# EAGLE design v110 (EAGLE 7.5.0)
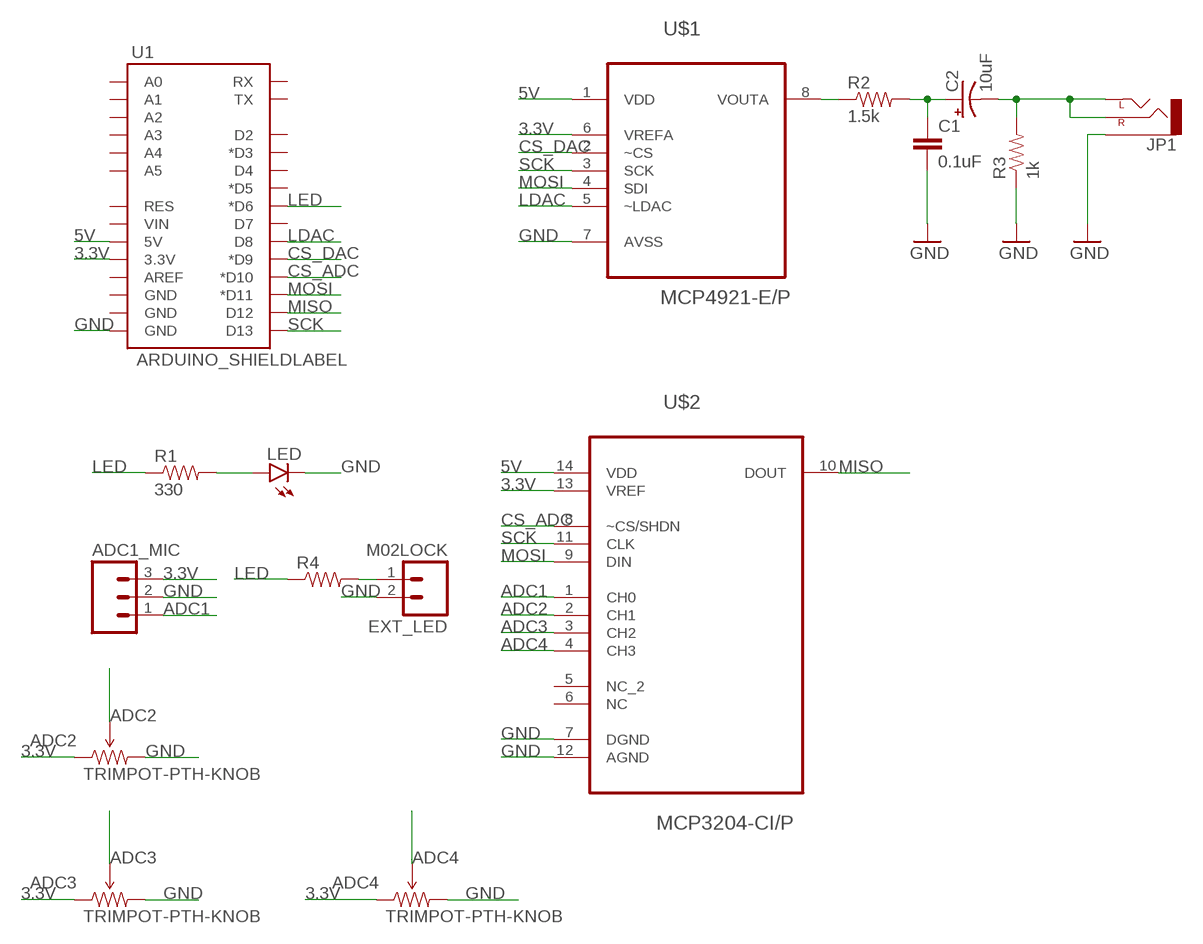
[diagram p0: schematic, sheet 1]

## Parts
ADC1_MIC  M03LOCK  [1X03_LOCK]
ADC2  TRIMPOT-PTH-KNOB  [3386U]
ADC3  TRIMPOT-PTH-KNOB  [3386U]
ADC4  TRIMPOT-PTH-KNOB  [3386U]
C1  0.1uF  CAPPTH1  [CAP-PTH-5MM]
C2  10uF  CAP_POLPTH2  [CPOL-RADIAL-10UF-25V]
EXT_LED  M02LOCK  [1X02_LOCK]
JP1  AUDIO-JACKPTH  [AUDIO-JACK]
LED  LED5MM  [LED5MM]
R1  330  1KOHM-1/4W-5%(PTH)  [AXIAL-0.3]
R2  1.5k  1KOHM-1/4W-5%(PTH)  [AXIAL-0.3]
R3  1k  1KOHM-1/4W-5%(PTH)  [AXIAL-0.3]
R4  1KOHM-1/4W-5%(PTH)  [AXIAL-0.3]
U1  ARDUINO_SHIELDLABEL  [DUEMILANOVE_SHIELD]
U$1  MCP4921-E/P  [DIP254P762X432-8]
U$2  MCP3204-CI/P  [DIP254P762X432-14]

## Nets
3.3V: ADC1_MIC.3 ADC2.1(CCW) ADC3.1(CCW) ADC4.1(CCW) U1.3.3V U$1.6(VREFA) U$2.13(VREF)
5V: U1.5V U$1.1(VDD) U$2.14(VDD)
ADC1: ADC1_MIC.1 U$2.1(CH0)
ADC2: ADC2.2(WIPER) U$2.2(CH1)
ADC3: ADC3.2(WIPER) U$2.3(CH2)
ADC4: ADC4.2(WIPER) U$2.4(CH3)
CS_ADC: U1.D10(*D10) U$2.8(~CS/SHDN)
CS_DAC: U1.D9(*D9) U$1.2(~CS)
GND: ADC1_MIC.2 ADC2.3(CW) ADC3.3(CW) ADC4.3(CW) C1.2 EXT_LED.2 JP1.SLEEVE LED.K(C) R3.P$1 U1.GND@0(GND) U$1.7(AVSS) U$2.7(DGND) U$2.12(AGND)
LDAC: U1.D8 U$1.5(~LDAC)
LED: R1.P$1 R4.P$1 U1.D6(*D6)
MISO: U1.D12 U$2.10(DOUT)
MOSI: U1.D11(*D11) U$1.4(SDI) U$2.9(DIN)
N$1: LED.A R1.P$2
N$2: R2.P$1 U$1.8(VOUTA)
N$3: C1.1 C2.1(+) R2.P$2
N$4: C2.2(-) JP1.RING(RIGHT) JP1.TIP(LEFT) R3.P$2
N$5: EXT_LED.1 R4.P$2
SCK: U1.D13 U$1.3(SCK) U$2.11(CLK)
Unconnected: U1.A0 U1.A1 U1.A2 U1.A3 U1.A4 U1.A5 U1.AREF U1.D2 U1.D3(*D3) U1.D4 U1.D5(*D5) U1.D7 U1.GND@1(GND) U1.GND@2(GND) U1.RES U1.RX U1.TX U1.VIN U$2.5(NC_2) U$2.6(NC)

## Library data of the parts
ADC1_MIC = SparkFun-Connectors:M03: Header 3 Standard 3-pin 0.1" header. Use with straight break away headers (SKU : PRT-00116), right angle break away headers (PRT-00553), swiss pins (PRT-00743), machine pins (PRT-00117), and female headers (PRT-00115). Molex polarized connector foot print use with SKU : PRT-08232 with associated crimp pins and housings.
ADC2-ADC4 = SparkFun-Electromechanical:TRIMPOT: Various small potentiometers for "set-and-forget" applications
C1 = SparkFun-Capacitors:CAP: Capacitor Standard 0603 ceramic capacitor, and 0.1" leaded capacitor.
C2 = SparkFun-Capacitors:CAP_POL: Capacitor Polarized These are standard SMD and PTH capacitors. Normally 10uF, 47uF, and 100uF in electrolytic and tantalum varieties. Always verify the external diameter of the through hole cap, it varies with capacity, voltage, and manufacturer. The EIA devices should be standard.
EXT_LED = SparkFun-Connectors:M02: Standard 2-pin 0.1" header. Use with - straight break away headers ( PRT-00116) - right angle break away headers (PRT-00553) - swiss pins (PRT-00743) - machine pins (PRT-00117) - female headers (PRT-00115) Molex polarized connector foot print use with: PRT-08233 with associated crimp pins and housings. 2.54_SCREWTERM for use with PRT-10571. 3.5mm Screw Terminal footprints for PRT-08084 5mm Screw Terminal footprints for use with PRT-08432
JP1 = SparkFun-Connectors:AUDIO-JACK: 3.5mm Audio Jack Simple 3.5mm common PCB mount audio jack. SKU: PRT-08032
LED = SparkFun-LED:LED: LEDs Standard schematic elements and footprints for 5mm, 3mm, 1206, and 0603 sized LEDs. 5mm - Spark Fun Electronics SKU : COM-00529 (and others)
R1-R4 = SparkFun-Resistors:1KOHM-1/4W-5%(PTH): RES-08380; PROD_ID: RES-08380; VALE: 1k
U1 = SparkFun-Boards:ARDUINO_SHIELD: Arduino shield footprint
U$1 = Microchip_By_element14_Batch_1:MCP4921-E/P: DAC; MPN: MCP4921-E/P; OC_FARNELL: 1332112; OC_NEWARK: 08J8743; PACKAGE: DIP-8; SUPPLIER: Microchip
U$2 = Microchip_By_element14_Batch_1:MCP3204-CI/P: A/D Converters; MPN: MCP3204-CI/P; OC_FARNELL: 9758593; OC_NEWARK: 19C7209; PACKAGE: DIP-14; SUPPLIER: Microchip

## Board
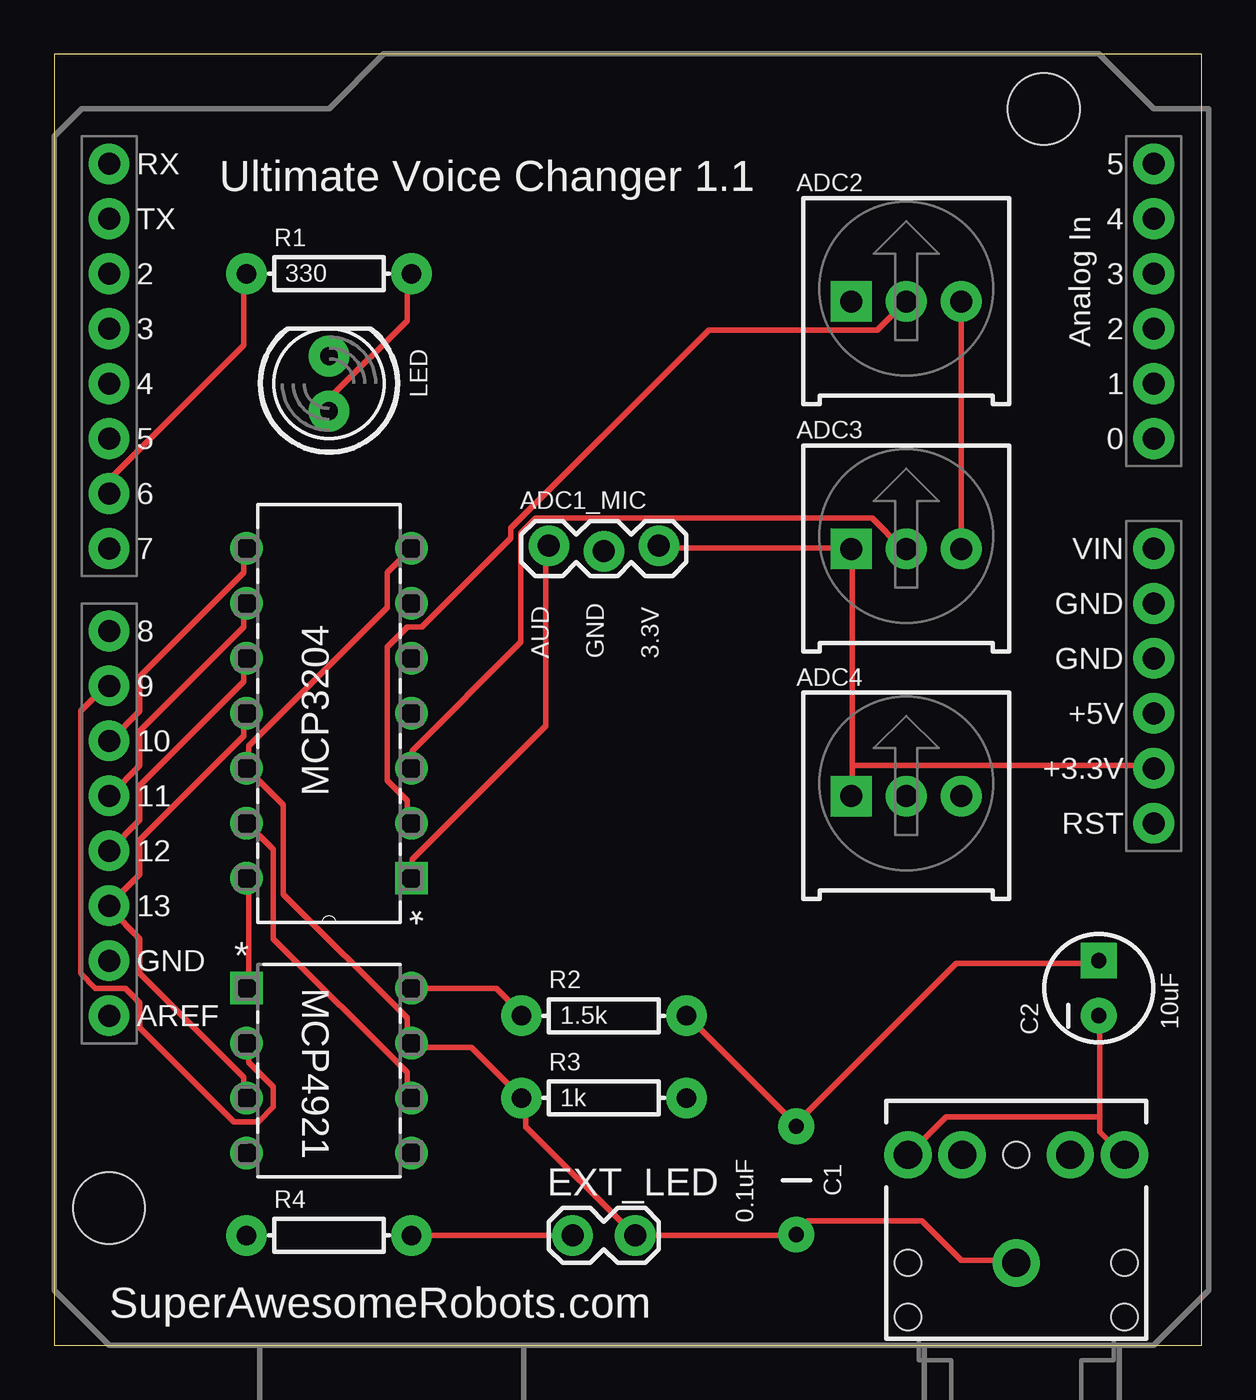
[diagram p1: board, top side]
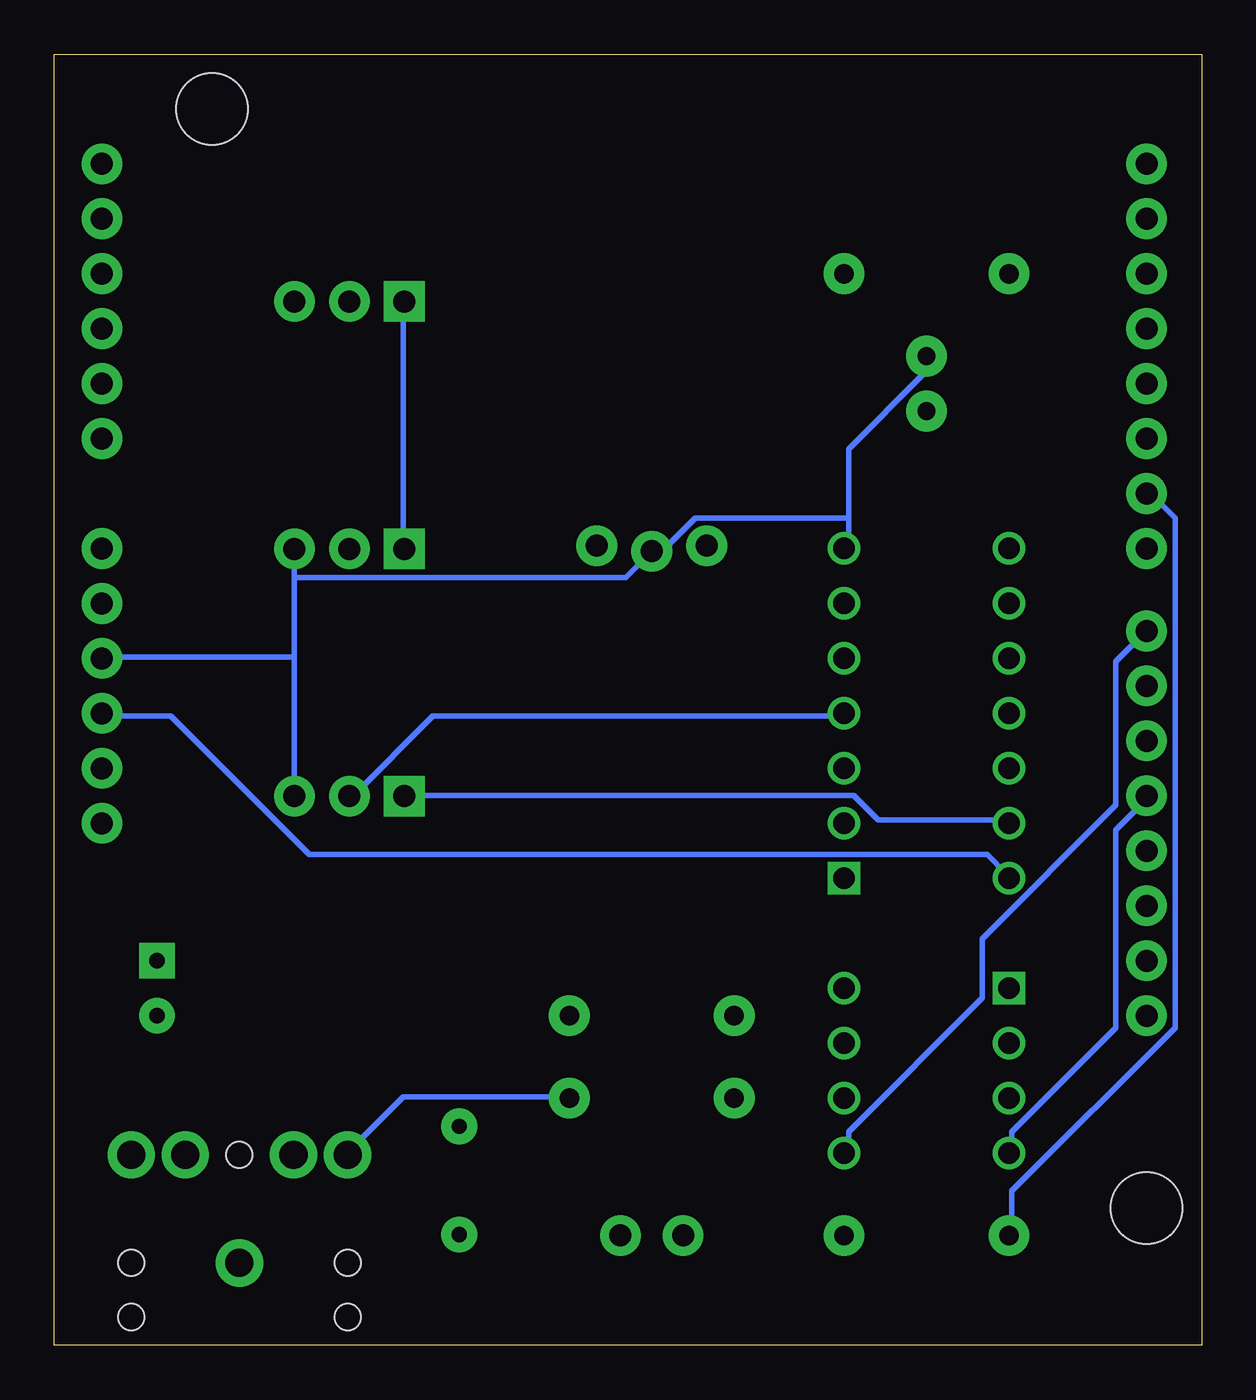
[diagram p2: board, bottom side, seen from below]

Size 53.01 x 59.68 mm. Coordinates in mm from the lower left corner, seen from the top.
Outline: 0,0 53.01,0 53.01,59.68 0,59.68 0,0
Copper layers (1*16): Top 0.035mm / dielectric 1.5mm / Bottom 0.035mm
Design rules "default": minimum track width 10mil, minimum drill 24mil, track to track 8mil, track to pad 8mil, pad to pad 8mil, via to via 8mil, smd to smd 8mil, copper to edge 40mil, drill to drill 8mil, minimum pad ring 10mil, minimum via ring 8mil, stop-mask expansion 4mil, vias tented up to drill 0mil, thermal gap 10mil

### Footprints (pad centres in the part's own frame; a part is rotated, then mirrored left to right if it is on the bottom)
1X03_LOCK = drill 1.016 pad 1.88: 1 0,0.127; 2 2.54,-0.127; 3 5.08,0.127
3386U = drill 1.016 pad 1.88 square: 1 -2.54,-0.015 | drill 1.016 pad 1.88: 2 0,-0.015; 3 2.54,-0.015
CAP-PTH-5MM = drill 0.7 pad 1.651: 1 -2.5,0; 2 2.5,0
CPOL-RADIAL-10UF-25V = drill 0.7 pad 1.651 square: 1 1.27,0 | drill 0.7 pad 1.651: 2 -1.27,0
1X02_LOCK = drill 1.016 pad 1.88: 1 -0.178,0; 2 2.718,0
AUDIO-JACK = drill 1.3 pad 2.184: RING 5,5; RSH 5,2.5; SLEEVE 0,0; TIP 5,-5; TSH 5,-2.5 | hole 1.2: 0,5; -2.5,5; -2.5,-5; 0,-5; 5,0
LED5MM = drill 0.813 pad 1.88: A -1.27,0; K 1.27,0
AXIAL-0.3 = drill 0.9 pad 1.88: P$1 -3.81,0; P$2 3.81,0
DUEMILANOVE_SHIELD = drill 1.016 pad 1.88: 3.3V 50.8,26.67; 5V 50.8,29.21; A0 50.8,41.91; A1 50.8,44.45; A2 50.8,46.99; A3 50.8,49.53; A4 50.8,52.07; A5 50.8,54.61; AREF 2.54,15.24; D2 2.54,49.53; D3 2.54,46.99; D4 2.54,44.45; D5 2.54,41.91; D6 2.54,39.37; D7 2.54,36.83; D8 2.54,33.02; D9 2.54,30.48; D10 2.54,27.94; D11 2.54,25.4; D12 2.54,22.86; D13 2.54,20.32; GND@0 50.8,31.75; GND@1 50.8,34.29; GND@2 2.54,17.78; RES 50.8,24.13; RX 2.54,54.61; TX 2.54,52.07; VIN 50.8,36.83 | hole 3.302: 45.72,57.15; 2.54,6.35
DIP254P762X432-8 = drill 0.991 square: 1 -7.62,7.62 | drill 0.991: 2 -7.62,5.08; 3 -7.62,2.54; 4 -7.62,0; 5 0,0; 6 0,2.54; 7 0,5.08; 8 0,7.62
DIP254P762X432-14 = drill 0.991 square: 1 -7.62,15.24 | drill 0.991: 2 -7.62,12.7; 3 -7.62,10.16; 4 -7.62,7.62; 5 -7.62,5.08; 6 -7.62,2.54; 7 -7.62,0; 8 0,0; 9 0,2.54; 10 0,5.08; 11 0,7.62; 12 0,10.16; 13 0,12.7; 14 0,15.24

### Placement (x,y rotation side)
ADC1_MIC  22.86,36.83 0 top
ADC2  39.37,48.26 0 top
ADC3  39.37,36.83 0 top
ADC4  39.37,25.4 0 top
C1  34.29,7.62 270 top
C2  48.26,16.51 90 top
EXT_LED  24.13,5.08 0 top
JP1  44.45,3.81 90 top
LED  12.7,44.45 90 top
R1  12.7,49.53 0 top
R2  25.4,15.24 0 top
R3  25.4,11.43 0 top
R4  12.7,5.08 0 top
U1  0,0 0 top
U$1  16.51,8.89 0 top
U$2  8.89,36.83 180 top

### Tracks (layer width: path | path; a pad name or v marks a point on that pad's centre or on a via)
3.3V
  Top 0.254: U$1.6 16.31,11.48 16.31,12.62 10.13,18.8 10.13,22.91 8.99,24.05 U$2.13 | 36.88,26.8 36.88,36.63 ADC3.1 36.65,36.85 27.96,36.85 ADC1_MIC.3 | 36.88,26.8 36.88,25.42 ADC4.1 | 36.88,26.8 50.6,26.8 U1.3.3V
  Bottom 0.254: ADC2.1 36.88,48.06 36.88,36.85 ADC3.1 | U$2.13 8.99,24.28 14.94,24.28 16.08,25.42 36.65,25.42 ADC4.1
5V
  Top 0.254: U$1.1 8.99,16.51 8.99,21.54 U$2.14
  Bottom 0.254: U1.5V 50.6,29.08 47.62,29.08 41.22,22.68 9.91,22.68 8.99,21.77 U$2.14
ADC1
  Top 0.254: U$2.1 16.54,21.77 16.54,22.45 22.71,28.63 22.71,36.85 ADC1_MIC.1
ADC2
  Top 0.254: U$2.2 16.31,24.28 16.31,25.2 15.39,26.11 15.39,32.28 16.31,33.2 16.99,33.2 21.11,37.31 21.11,37.77 30.25,46.91 38.02,46.91 39.17,48.06 ADC2.2
ADC3
  Top 0.254: U$2.3 16.54,26.8 16.54,27.48 21.57,32.51 21.57,37.54 22.25,38.23 37.79,38.23 39.17,36.85 ADC3.2
ADC4
  Bottom 0.254: U$2.4 16.54,29.08 35.51,29.08 39.17,25.42 ADC4.2
CS_ADC
  Top 0.254: U$2.8 8.76,36.63 8.76,35.71 3.96,30.91 3.96,29.31 2.59,27.94 U1.D10
CS_DAC
  Top 0.254: U$1.2 8.99,13.77 8.99,13.08 10.13,11.94 10.13,11.02 9.45,10.34 8.31,10.34 3.96,14.68 3.96,15.82 3.28,16.51 1.9,16.51 1.22,17.2 1.22,29.31 2.36,30.45 U1.D9
GND
  Top 0.254: JP1.SLEEVE 44.42,3.94 41.91,3.94 40.08,5.77 34.82,5.77 34.37,5.31 C1.2 34.14,5.08 EXT_LED.2 26.82,5.08 21.79,10.11 21.79,11.25 R3.P$1 21.57,11.48 19.28,13.77 16.54,13.77 U$1.7 16.31,13.99 16.31,15.14 10.59,20.85 10.59,24.97 U$2.12 8.99,26.8 8.99,27.71 15.39,34.11 15.39,35.71 U$2.7 | ADC3.3 ADC2.3
  Bottom 0.254: ADC3.3 41.91,35.48 | 41.91,35.48 41.91,31.83 | 41.91,31.83 ADC4.3 | 41.91,31.83 50.6,31.83 U1.GND@0 | 16.31,38.23 16.31,36.85 U$2.7 | 16.31,38.23 16.31,41.43 12.88,44.86 12.88,45.54 LED.K | 16.31,38.23 23.39,38.23 24.77,36.85 25.22,36.85 ADC1_MIC.2 25.45,36.63 26.59,35.48 41.91,35.48
LDAC
  Bottom 0.254: U1.D8 3.96,31.6 3.96,24.97 10.13,18.8 10.13,16.05 16.31,9.88 16.31,8.97 U$1.5
LED
  Top 0.254: U1.D6 2.59,39.37 2.59,40.06 8.76,46.23 8.76,49.43 R1.P$1
  Bottom 0.254: R4.P$1 8.76,5.08 8.76,7.14 1.22,14.68 1.22,38.23 2.36,39.37 U1.D6
MISO
  Top 0.254: U1.D12 3.96,24.28 3.96,25.88 8.76,30.68 8.76,31.6 U$2.10
MOSI
  Top 0.254: U$2.9 8.76,34.11 8.76,33.2 3.96,28.4 3.96,26.8 2.59,25.42 U1.D11
  Bottom 0.254: U$1.4 8.76,8.97 8.76,9.88 3.96,14.68 3.96,23.82 2.59,25.2 U1.D11
N$1
  Top 0.254: LED.A 12.88,43.26 12.88,43.94 16.31,47.37 16.31,49.43 R1.P$2
N$2
  Top 0.254: U$1.8 20.42,16.51 21.57,15.37 R2.P$1
N$3
  Top 0.254: R2.P$2 29.34,15.14 34.14,10.34 C1.1 34.37,10.34 41.68,17.65 48.08,17.65 C2.1
N$4
  Top 0.254: 48.31,10.57 48.31,9.88 49.22,8.97 JP1.TIP | 48.31,10.57 48.31,15.14 C2.2 | 48.31,10.57 41.22,10.57 39.62,8.97 JP1.RING
  Bottom 0.254: R3.P$2 29.34,11.48 36.88,11.48 39.39,8.97 JP1.RING
N$5
  Top 0.254: EXT_LED.1 R4.P$2
SCK
  Top 0.254: U$1.3 8.76,11.48 8.76,12.39 3.96,17.2 3.96,18.8 2.59,20.17 U1.D13 2.59,20.4 3.96,21.77 3.96,23.37 8.76,28.17 8.76,29.08 U$2.11

### Text on the board
tPlace: Ultimate Voice Changer 1.1 | ADC2 | ADC3 | AUD | GND | 3.3V | ADC4 | MCP3204 | MCP4921 | SuperAwesomeRobots.com